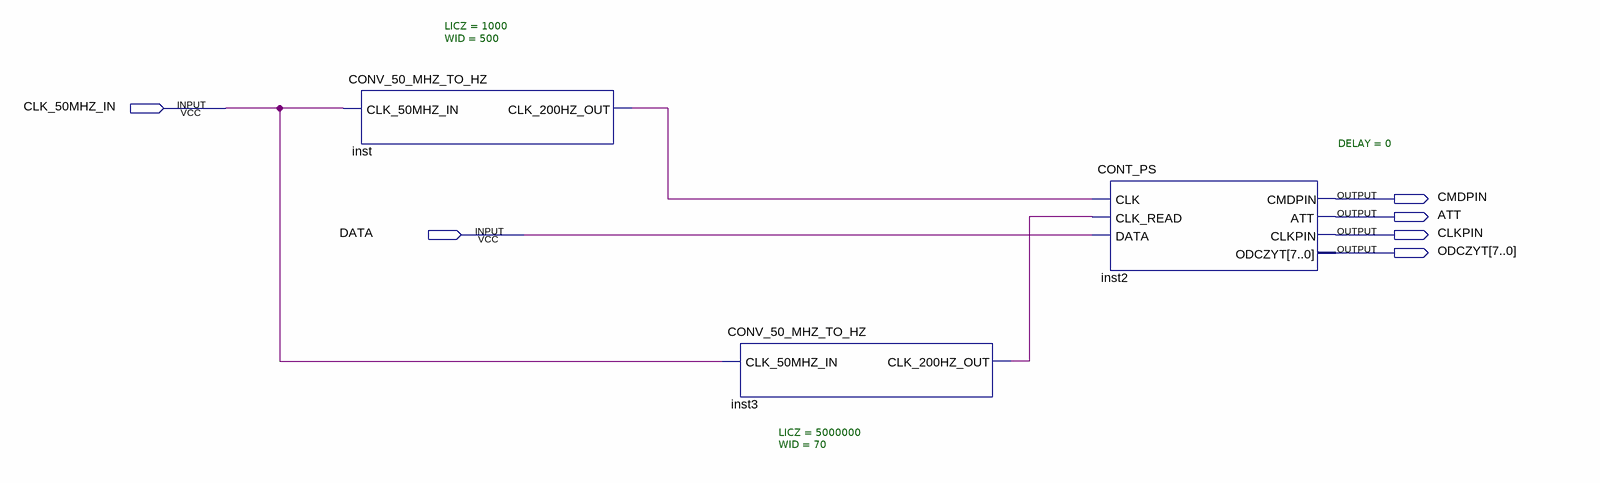
[diagram p0: schematic sheet]
// Quartus schematic controller.bdf as structural Verilog: 3 symbols, 6 pins
module controller (
  input  CLK_50MHZ_IN,
  input  DATA,
  output CMDPIN,
  output ATT,
  output CLKPIN,
  output [7:0] ODCZYT
);

  wire inst3_clk_200hz_out, inst_clk_200hz_out;

  CONV_50_MHZ_TO_HZ #(.LICZ(1000), .WID(500)) inst (.CLK_50MHZ_IN(CLK_50MHZ_IN), .CLK_200HZ_OUT(inst_clk_200hz_out));
  CONV_50_MHZ_TO_HZ #(.LICZ(5000000), .WID(70)) inst3 (
    .CLK_50MHZ_IN(CLK_50MHZ_IN), .CLK_200HZ_OUT(inst3_clk_200hz_out));
  CONT_PS #(.DELAY(0)) inst2 (
    .CLK(inst_clk_200hz_out), .CLK_READ(inst3_clk_200hz_out), .DATA(DATA), .CMDPIN(CMDPIN), .ATT(ATT),
    .CLKPIN(CLKPIN), .ODCZYT(ODCZYT));
endmodule
